# Altium schematic sheet Connector.SchDoc: QUTMS Shutdown V2 - Connector
size A4; Organization: QUT Motorsport; Address1: O-120; Address2: O Block; Address3: QUT Gardens Point; Address4: Brisbane, 4000; DocumentNumber: 3; SheetNumber: 3; SheetTotal: 13
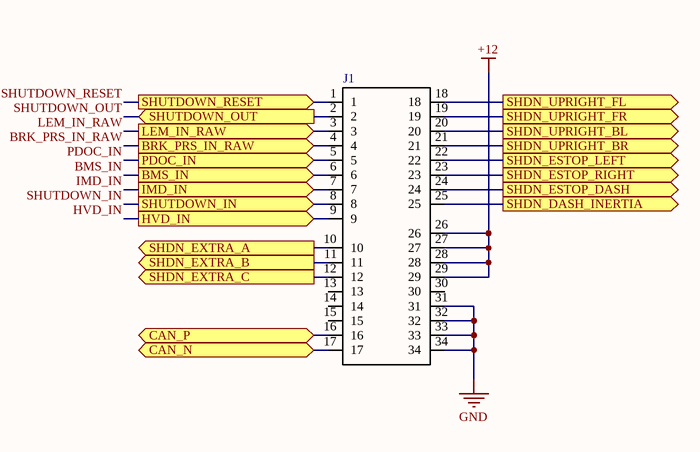
[diagram p0: Connector.SchDoc]

## Parts
J1  6437288-2  [TE_6437288-2]  (value not drawn)

## Ports
BMS_IN (out), BRK_PRS_IN_RAW (out), CAN_N (bidir), CAN_P (bidir), HVD_IN (out), IMD_IN (out), LEM_IN_RAW (out), PDOC_IN (out), SHDN_DASH_INERTIA (out), SHDN_ESTOP_DASH (out), SHDN_ESTOP_LEFT (out), SHDN_ESTOP_RIGHT (out), SHDN_EXTRA_A (out), SHDN_EXTRA_B (out), SHDN_EXTRA_C (out), SHDN_UPRIGHT_BL (out), SHDN_UPRIGHT_BR (out), SHDN_UPRIGHT_FL (out), SHDN_UPRIGHT_FR (out), SHUTDOWN_IN (out), SHUTDOWN_OUT (in), SHUTDOWN_RESET (out)

## Nets
+12: J1.26 J1.27 J1.28 J1.29
GND: J1.31 J1.32 J1.33 J1.34
BMS_IN: J1.6 ; port BMS_IN
BRK_PRS_IN_RAW: J1.4 ; port BRK_PRS_IN_RAW
CAN_N: J1.17 ; port CAN_N
CAN_P: J1.16 ; port CAN_P
HVD_IN: J1.9 ; port HVD_IN
IMD_IN: J1.7 ; port IMD_IN
LEM_IN_RAW: J1.3 ; port LEM_IN_RAW
PDOC_IN: J1.5 ; port PDOC_IN
SHDN_DASH_INERTIA: J1.25 ; port SHDN_DASH_INERTIA
SHDN_ESTOP_DASH: J1.24 ; port SHDN_ESTOP_DASH
SHDN_ESTOP_LEFT: J1.22 ; port SHDN_ESTOP_LEFT
SHDN_ESTOP_RIGHT: J1.23 ; port SHDN_ESTOP_RIGHT
SHDN_EXTRA_A: J1.10 ; port SHDN_EXTRA_A
SHDN_EXTRA_B: J1.11 ; port SHDN_EXTRA_B
SHDN_EXTRA_C: J1.12 ; port SHDN_EXTRA_C
SHDN_UPRIGHT_BL: J1.20 ; port SHDN_UPRIGHT_BL
SHDN_UPRIGHT_BR: J1.21 ; port SHDN_UPRIGHT_BR
SHDN_UPRIGHT_FL: J1.18 ; port SHDN_UPRIGHT_FL
SHDN_UPRIGHT_FR: J1.19 ; port SHDN_UPRIGHT_FR
SHUTDOWN_IN: J1.8 ; port SHUTDOWN_IN
SHUTDOWN_OUT: J1.2 ; port SHUTDOWN_OUT
SHUTDOWN_RESET: J1.1 ; port SHUTDOWN_RESET

Not connected (* = marked no-connect by the designer): J1 13 14 15 30

## Notes on the sheet
- Title
- Size:
- Date:
- A4
- Number:
- Time:
- Revision:
- Sheet
- of
- File:

## Library data of the parts
J1 = 6437288-2: Conn Wire to Board RCP 34 POS 1.5mm Solder RA Thru-Hole Automotive Tube; MF: TE Connectivity; SnapEDA_Link: https://www.snapeda.com/parts/6437288-2/TE%20Connectivity%20AMP%20Connectors/view-part/?ref=snap; EU_RoHS_Compliance: Compliant; TE_purchase_URL: https://www.te.com/usa-en/product-6437288-2.html?te_bu=Cor&te_type=disp&te_campaign=seda_glo_cor-seda-global-disp-prtnr-fy19-seda-model-bom-cta_sma-317_1&elqCampaignId=32493; MP: 6437288-2; Package: None; Digi-Key_Purchase_URL: https://www.digikey.com/product-detail/en/te-connectivity-amp-connectors/6437288-2/A142477-ND/5428602?utm_source=snapeda&utm_medium=aggregator&utm_campaign=symbol; Digi-Key_Part_Number: A142477-ND; Value: *